# Altium project EduSAT EPSv2.PrjPcb (part 2 of 2)
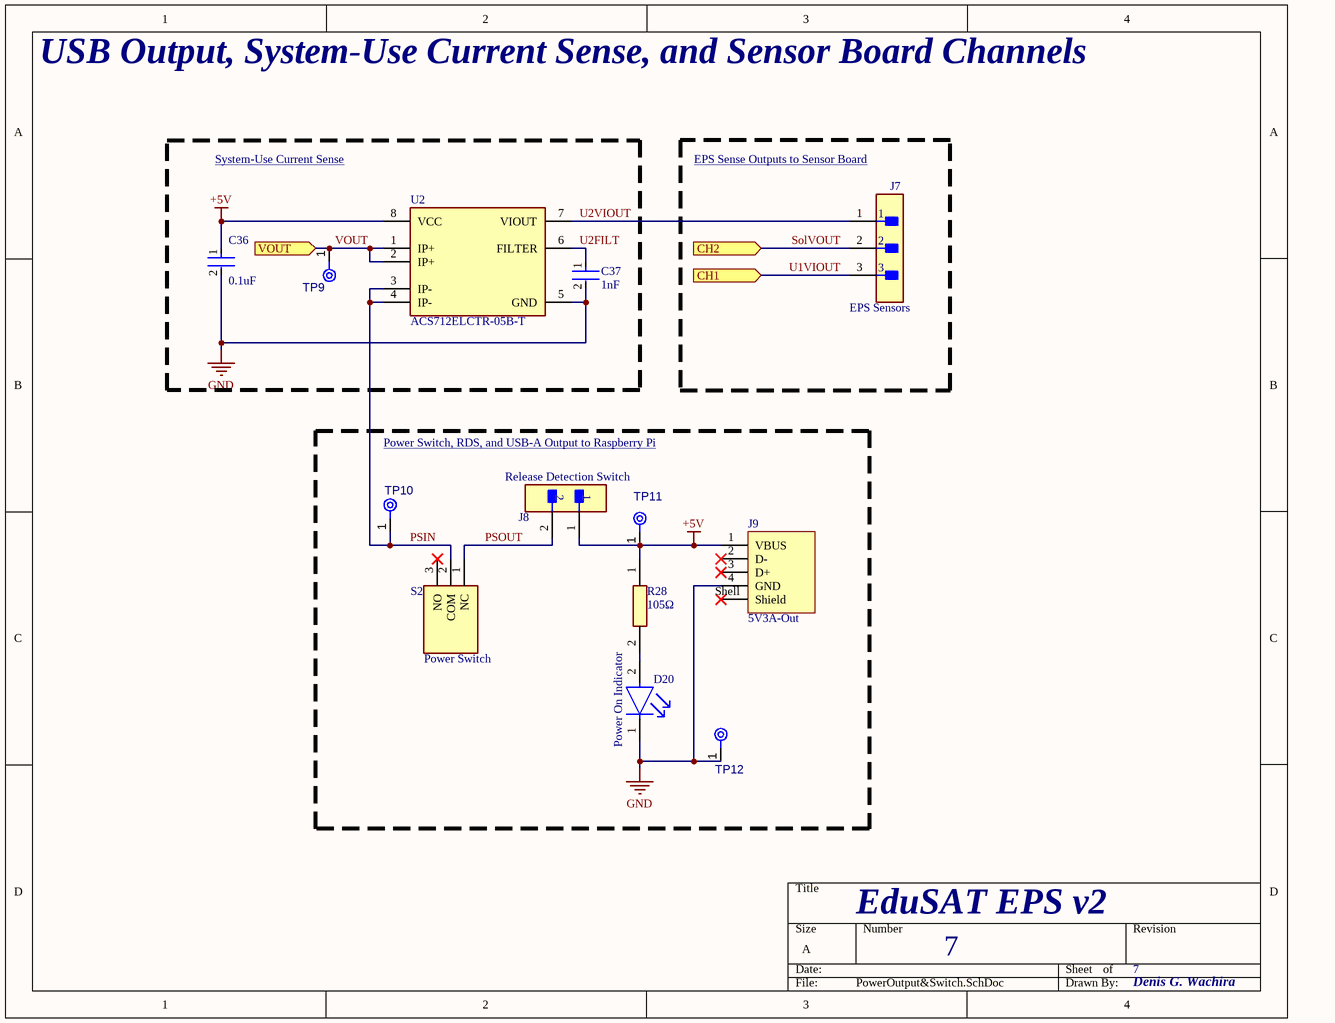
[diagram p7: PowerOutput&Switch.SchDoc]

## Nets that join several sheets
+5V: PowerInput&Switch (C2.1 U1.8), PowerOutput&Switch (6 pins)
GND: BatteryConn&Protection (6 pins), Charging&1AOut1 (14 pins), PowerInput&Switch (12 pins), Charging&1AOut2 (14 pins), Charging&1AOut3 (14 pins), PowerOutput&Switch (6 pins)
BAT1: BatteryConn&Protection (5 pins), Charging&1AOut1 (C8.1 IC4.6 L1.2 R18.1)
BAT2: BatteryConn&Protection (5 pins), Charging&1AOut2 (C18.1 IC6.6 L2.2 R22.1)
BAT3: BatteryConn&Protection (5 pins), Charging&1AOut3 (C28.1 IC8.6 L3.2 R26.1)
SolVOUT: PowerInput&Switch (R2.2 R3.1), PowerOutput&Switch (J7.2)
U1VIOUT: PowerInput&Switch (U1.7), PowerOutput&Switch (J7.3)
VIN: Charging&1AOut1 (C7.1 IC4.1 R16.1), PowerInput&Switch (S1.2 TP2.1), Charging&1AOut2 (C17.1 IC6.1 R20.1), Charging&1AOut3 (C27.1 IC8.1 R24.1)
VOUT: Charging&1AOut1 (C14.1 C15.1 IC5.1), Charging&1AOut2 (C24.1 C25.1 IC7.1), Charging&1AOut3 (C34.1 C35.1 IC9.1), PowerOutput&Switch (TP9.1 U2.1 U2.2)